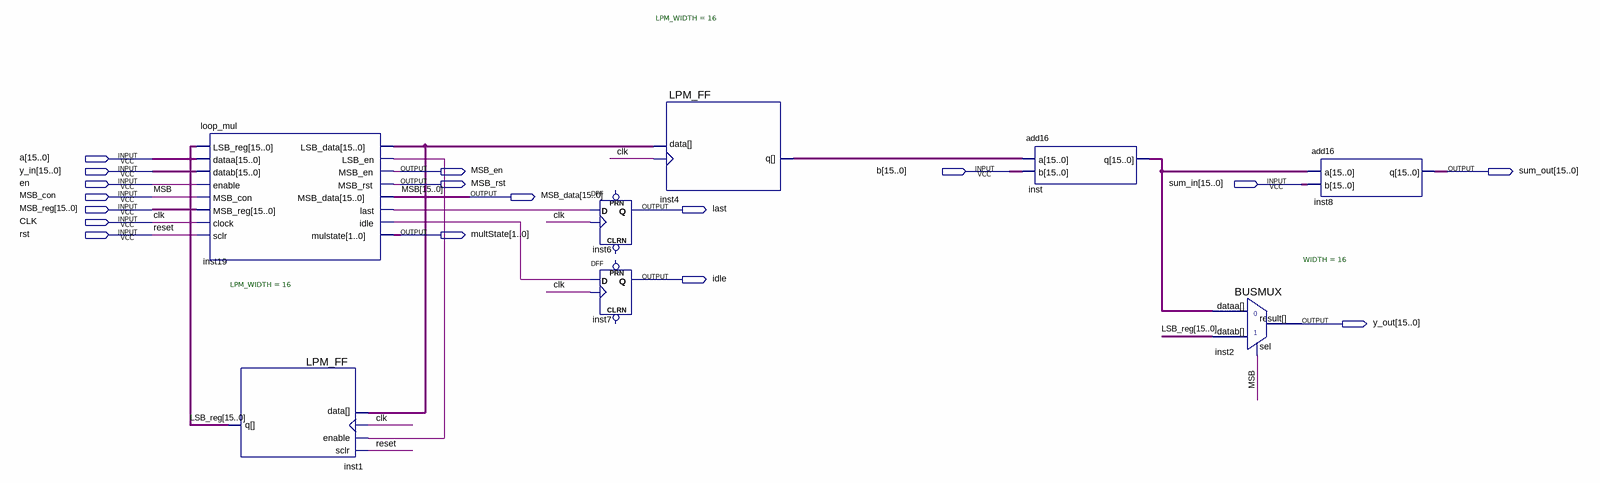
[diagram p0: schematic sheet]
// Quartus schematic MAD.bdf as structural Verilog: 8 symbols, 17 pins
module MAD (
  input  [15:0] a,
  input  [15:0] y_in,
  input  [15:0] b,
  input  en,
  input  [15:0] sum_in,
  input  MSB_con,
  input  [15:0] MSB_reg,
  input  CLK,
  input  rst,
  output MSB_en,
  output [15:0] sum_out,
  output MSB_rst,
  output [15:0] MSB_data,
  output last,
  output [1:0] multState,
  output idle,
  output [15:0] y_out
);

  wire inst19_idle, inst19_last, inst19_lsb_en;
  wire [15:0] inst4_q, inst19_lsb_data, inst_q, LSB_reg;

  loop_mul inst19 (
    .LSB_reg(LSB_reg), .dataa(a), .datab(y_in), .enable(en), .MSB_con(MSB_con), .MSB_reg(MSB_reg),
    .clock(CLK), .sclr(rst), .LSB_data(inst19_lsb_data), .LSB_en(inst19_lsb_en), .MSB_en(MSB_en),
    .MSB_rst(MSB_rst), .MSB_data(MSB_data), .last(inst19_last), .idle(inst19_idle), .mulstate(multState));
  LPM_FF #(.LPM_WIDTH(16)) inst1 (.enable(inst19_lsb_en), .clock(CLK), .sclr(rst), .data(inst19_lsb_data), .q(LSB_reg));
  DFF inst6 (.CLK(CLK), .D(inst19_last), .Q(last));  // open: CLRN, PRN
  DFF inst7 (.CLK(CLK), .D(inst19_idle), .Q(idle));  // open: CLRN, PRN
  LPM_FF #(.LPM_WIDTH(16)) inst4 (.clock(CLK), .data(inst19_lsb_data), .q(inst4_q));
  add16 inst (.a(inst4_q), .b(b), .q(inst_q));
  BUSMUX #(.WIDTH(16)) inst2 (.datab(LSB_reg), .sel(MSB_con), .dataa(inst_q), .result(y_out));
  add16 inst8 (.a(inst_q), .b(sum_in), .q(sum_out));

  // Other names for the same wires on the sheet: MSB (some bits) = {MSB_data[15:1], MSB_con, MSB_data[0]};
  //   reset = rst
endmodule
